# Altium project changevoltage.PrjPcb
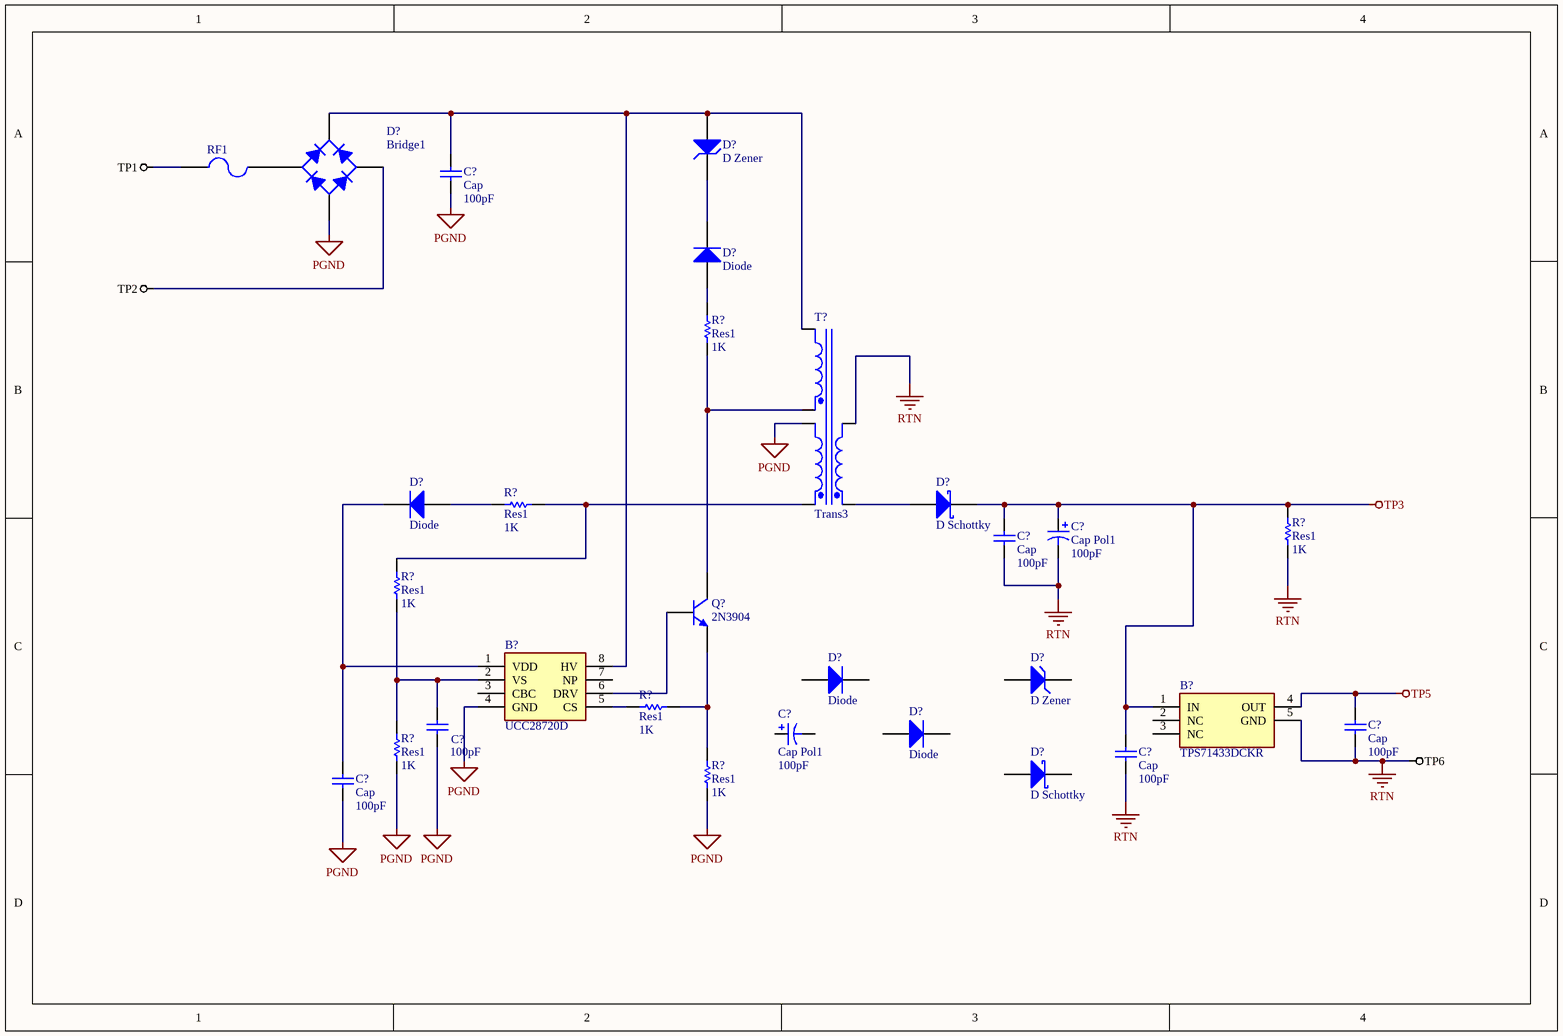
[diagram p0: changevoltage.SchDoc]
1 sheet, 29 parts. Net scope: global (net labels, ports and power ports of the same name join across sheets).

## Sheet changevoltage.SchDoc
size A4; SheetNumber: 1; SheetTotal: 1; SPICEModelCacheENYHUKQB: <root> / <DocumentId>ENYHUKQB</DocumentId> / <CacheFrame Number="0"> / <Model Name="fuse" Kind="CKT"> / <Text>.SUBCKT FUSE 1 2 PARAMS: CURRENT=1 RESISTANCE=1m / SW1 1 2 3 0 SMOD OFF / BNLV 3 0 V=(abs(v(1,2))) / .MODEL SMOD SW (VT={(CURRENT*RESISTANCE)} RON=1g ROFF={RESISTANCE}) / .ENDS FUSE</Text> / </Model> / <Model Name="bridge" Kind="CKT"> / <Text>*Default Diode Bridge Rectifier / *Connections: / *              V- / *              | AC1 / *              | | V+ / *              | | | AC2 / *              | | | | / .SUBCKT BRIDGE 1 2 3 4 / D1 1 2 DMOD / D2 1 4 DMOD / D3 2 3 DMOD / D4 4 3 DMOD / .MODEL DMOD D () / .ENDS BRIDGE</Text> / </Model> / <Model Name="diode" Kind="MDL"> / <Text>*Default Diode / *Diode Pinout: A,K / .MODEL DIODE D()</Text> / </Model> / <Model Name="zener" Kind="MDL"> / <Text>*ZENER / *Default Zener 10V @ 10mA / *Zener Diode Pinout: A,K / .MODEL ZENER D( BV=10 IBV=10E-3 )</Text> / </Model> / <Model Name="skydiode" Kind="MDL"> / <Text>*Default Schottky Diode / *Schottky Diode Pinout: A,K / .MODEL SKYDIODE D(EG=0.69 XTI=2)</Text> / </Model> / <Model Name="ni3wtrans" Kind="CKT"> / <Text>*Non-ideal 4-winding Transformer / *jjt created 18/1/2001. / *jjt 18/1/2002: changed LX2D,LX3D comments to match subcircuit parameters (X2D, X3D) to avoid possible confusion. / *Connections: / *                 Pri+ / *                 |   Pri- / *                 |   |   Sec1+ / *                 |   |   |   Sec1- / *                 |   |   |   |   Sec2+ / *                 |   |   |   |   |   Sec2- / *                 |   |   |   |   |   | / *                 |   |   |   |   |   | / *                 |   |   |   |   |   | / *                 |   |   |   |   |   | / .SUBCKT NI3WTRANS 1   2   3   4   5   6      PARAMS: RATIO1=1 RATIO2=1 RPRI=0.1 R2D=0.1 R3D=0.1 L1=1U / + X2D=1u X3D=1u XM=1k RCORE=1Meg / VISRC1   4 11 0V / VISRC2   6 14 0V / FCTRL1   10 2 VISRC1 {RATIO1} / FCTRL2   13 2 VISRC2 {RATIO2} / EVCVS1   3 11 10 2 {RATIO1} / EVCVS2   5 14 13 2 {RATIO2} / RRPRI    1 8 {RPRI} / RR2D    9 10 {R2D} / RR3D    12 13 {R3D} / LL1   8 7 {L1} / LX2D  7 9 {X2D} / LX3D  7 12 {X3D} / LXM   7 2 {XM} / RRCORE 7 2 {RCORE} / .ENDS NI3WTRANS</Text> / </Model> / <Model Name="2n3904" Kind="MDL"> / <Text>*2N3904 / *Si 310mW  40V 200mA 300MHz pkg:TO-92B 1,2,3 / .MODEL 2N3904 NPN(IS=1.4E-14 BF=300 VAF=100 IKF=0.025 ISE=3E-13 / + BR=7.5 RC=2.4 CJE=4.5E-12 TF=4E-10 CJC=3.5E-12 TR=2.1E-8 XTB=1.5 KF=9E-16 )</Text> / </Model> / </CacheFrame> / </root>

### Parts
(Parts that share a designator on the sheet are numbered #1, #2 ... from top to bottom, then left to right.)
B?#1  UCC28720D  [SOIC127P600X175-8N]
B?#2  TPS71433DCKR  [SOT65P210X110-5N]
C?#1  Cap  value 100pF  [RAD-0.3]
C?#2  Cap Pol1  value 100pF  [RB7.6-15]
C?#3  Cap  value 100pF  [RAD-0.3]
C?#4  Cap Pol1  value 100pF  [RB7.6-15]
C?#5  value 100pF  [RAD-0.3]
C?#6  Cap  value 100pF  [RAD-0.3]
C?#7  Cap  value 100pF  [RAD-0.3]
C?#8  Cap  value 100pF  [RAD-0.3]
D?#1  D Zener  [DIODE-0.7]
D?#2  Bridge1  [D-38]
D?#3  Diode  [SMC]
D?#4  D Schottky  [SMB]
D?#5  Diode  [SMC]
D?#6  Diode  [SMC]
D?#7  D Zener  [DIODE-0.7]
D?#8  Diode  [SMC]
D?#9  D Schottky  [SMB]
Q?  2N3904  [TO-92A]
R?#1  Res1  value 1K  [AXIAL-0.3]
R?#2  Res1  value 1K  [AXIAL-0.3]
R?#3  Res1  value 1K  [AXIAL-0.3]
R?#4  Res1  value 1K  [AXIAL-0.3]
R?#5  Res1  value 1K  [AXIAL-0.3]
R?#6  Res1  value 1K  [AXIAL-0.3]
R?#7  Res1  value 1K  [AXIAL-0.3]
RF1  (no value)  [PIN-W2/E2.8]
T?  Trans3  [TRF_6]

### Nets
PGND: B?#1.4(GND) C?#1.1 C?#5.1 C?#8.1 D?#2.3(A) R?#6.1 R?#7.1 T?.4(Sec1-)
RTN: B?#2.5(GND) C?#2.2 C?#3.1 C?#6.1 C?#7.1 R?#3.1 T?.2(Pri-)  [also labelled TP6]
TP1: RF1.1
TP2: D?#2.2(C)
TP3: B?#2.1(IN) C?#2.1 C?#3.2 C?#7.2 D?#4.2(K) R?#3.2
TP5: B?#2.4(OUT) C?#6.2
NetB?#1_1: B?#1.1(VDD) C?#8.2 D?#5.2(K)
NetB?#1_2: B?#1.2(VS) C?#5.2 R?#4.1 R?#6.2
NetB?#1_5: B?#1.5(CS) R?#5.2
NetB?#1_6: B?#1.6(DRV) Q?.2(B)
NetB?#1_8: B?#1.8(HV) C?#1.2 D?#1.1(A) D?#2.1(K) T?.6(Sec2-)
NetD?#1_2: D?#1.2(K) D?#3.2(K)
NetD?#2_4: D?#2.4(C) RF1.2
NetD?#3_1: D?#3.1(A) R?#1.2
NetD?#4_1: D?#4.1(A) T?.1(Pri+)
NetD?#5_1: D?#5.1(A) R?#2.1
NetQ?_1: Q?.1(E) R?#5.1 R?#7.2
NetQ?_3: Q?.3(C) R?#1.1 T?.5(Sec2+)
NetR?#2_2: R?#2.2 R?#4.2 T?.3(Sec1+)

Not connected (* = marked no-connect by the designer): B?#1 3(CBC) 7(NP); B?#2 2(NC) 3(NC); C?#4 1 2; D?#6 1(A) 2(K); D?#7 1(A) 2(K); D?#8 1(A) 2(K); D?#9 1(A) 2(K)

### Library data of the parts
B?#1 = UCC28720D: , Battery Charge Controller IC; Manufacturer_Name: Texas Instruments; Geometry.Height: 1.75mm; Manufacturer_Part_Number: UCC28720D; Mouser Part Number: 595-UCC28720D; Mouser Price/Stock: https://www.mouser.co.uk/ProductDetail/Texas-Instruments/UCC28720D?qs=e1ok2LiJcmYvgKRFBJpQtg%3D%3D; Arrow Part Number: UCC28720D; Arrow Price/Stock: https://www.arrow.com/en/products/ucc28720d/texas-instruments?region=nac; Datasheet Link: http://www.ti.com/general/docs/lit/getliterature.tsp?genericPartNumber=UCC28720&&fileType=pdf
B?#2 = TPS71433DCKR: 80mA, 10V, Quiescent Current 3.0uA, LDO Linear Regulator in SC70 or SON2x2; Manufacturer_Name: Texas Instruments; Geometry.Height: 1.1mm; Manufacturer_Part_Number: TPS71433DCKR; Mouser Part Number: 595-TPS71433DCKR; Mouser Price/Stock: https://www.mouser.co.uk/ProductDetail/Texas-Instruments/TPS71433DCKR?qs=IDSsxkoac0x6IjxC0ajrbA%3D%3D; Arrow Part Number: *; Arrow Price/Stock: *; Datasheet Link: http://www.ti.com/lit/gpn/TPS714
C?#1 C?#3 C?#5-C?#8 = Cap: Capacitor; Published: 8-Jun-2000; LatestRevisionDate: 17-Jul-2002; LatestRevisionNote: Re-released for DXP Platform.; PackageReference: RAD-0.3; Publisher: Altium Limited; PackageDescription: Radial Cap, Thru-Hole; 2 Leads; 0.3 in Pin Spacing
C?#2 C?#4 = Cap Pol1: Polarized Capacitor (Radial); Published: 8-Jun-2000; LatestRevisionDate: 17-Jul-2002; LatestRevisionNote: Re-released for DXP Platform.; PackageReference: RB7.6-15; Publisher: Altium Limited; PackageDescription: Polarized Capacitor (Radial); 2 Leads
D?#1 D?#7 = D Zener: Zener Diode; Published: 8-Jun-2000; LatestRevisionDate: 17-Jul-2002; LatestRevisionNote: Re-released for DXP Platform.; PackageReference: DIODE-0.7; Publisher: Altium Limited; PackageDescription: Diode, Thru-Hole; 2 Leads; 0.7 in Pin Spacing
D?#2 = Bridge1: Full Wave Diode Bridge; Published: 8-Jun-2000; LatestRevisionDate: 29-May-2009; LatestRevisionNote: Sch pins A & K swapped.; DatasheetVersion: E2732B; PackageReference: D-38; Publisher: Altium Limited; PackageDescription: Bridge Rectifier; 4 Terminals; Body 9.4 x 9.4 mm (typ); Pitch 5.08 mm
D?#3 D?#5 D?#6 D?#8 = Diode: Default Diode; Published: 8-Jun-2000; LatestRevisionDate: 17-Jul-2002; LatestRevisionNote: Re-released for DXP Platform.; PackageVersion: Sep-1996; PackageReference: SMC; Publisher: Altium Limited; PackageDescription: DO-214-AB/SMC; 2 C-Bend Leads; Body 7.9 x 5.9 mm, inc. leads (LxW); Code_JEDEC: DO-214-AB
D?#4 D?#9 = D Schottky: Schottky Diode; Published: 8-Jun-2000; LatestRevisionDate: 17-Jul-2002; LatestRevisionNote: Re-released for DXP Platform.; PackageReference: SMB; Publisher: Altium Limited; PackageDescription: DO-214-AA/SMB; 2 C-Bend Leads; Body 5.3 x 3.6 mm, inc. leads (LxW); Code_JEDEC: DO-214-AA
Q? = 2N3904: NPN General Purpose Amplifier; Published: 8-Jun-2000; LatestRevisionDate: 15-Jan-2003; LatestRevisionNote: PCB Footprint 'BCY-W3/D4.7' replaced; DatasheetVersion: 1997; PackageVersion: Sep-1998; PackageReference: TO-92A; Publisher: Altium Limited; PackageDescription: TO, Flat Index; 3 In-Line, Axial Leads; Body Dia. 4.5mm; Leads 0.51 x 0.48 mm (max); ComponentLink1Description: Manufacturer Link; ComponentLink1URL: http://www.fairchildsemi.com/; ComponentLink2Description: Datasheet; ComponentLink2URL: http://www.fairchildsemi.com/ds/2N%2F2N3904.pdf
R?#1-R?#7 = Res1: Resistor; Published: 8-Jun-2000; LatestRevisionDate: 17-Jul-2002; LatestRevisionNote: Re-released for DXP Platform.; PackageReference: AXIAL-0.3; Publisher: Altium Limited; PackageDescription: Axial Device, Thru-Hole; 2 Leads; 0.3 in Pin Spacing
RF1 = Fuse 2: Fuse; Published: 8-Jun-2000; LatestRevisionDate: 17-Jul-2002; LatestRevisionNote: Re-released for DXP Platform.; PackageReference: PIN-W2/E2.8; Publisher: Altium Limited; PackageDescription: Thru-Hole; 2 Leads
T? = Trans3: Three-winding Transformer (Non-Ideal); Sim Note: Enter the turns ratios, Core loss resistance, Magnetising Reactance, Leakage Reactances and Resistances referred to the primary side into the parameter fields.; Published: 25-Jan-2001; LatestRevisionDate: 17-Jul-2002; LatestRevisionNote: Re-released for DXP Platform.; PackageReference: TRF_6; Publisher: Altium Limited; PackageDescription: Transformer; 6 Leads